# Altium schematic sheet GZ7_1_x-CORE.SchDoc: GZ8-4-0
size B; SheetNumber: 3; SheetTotal: 10
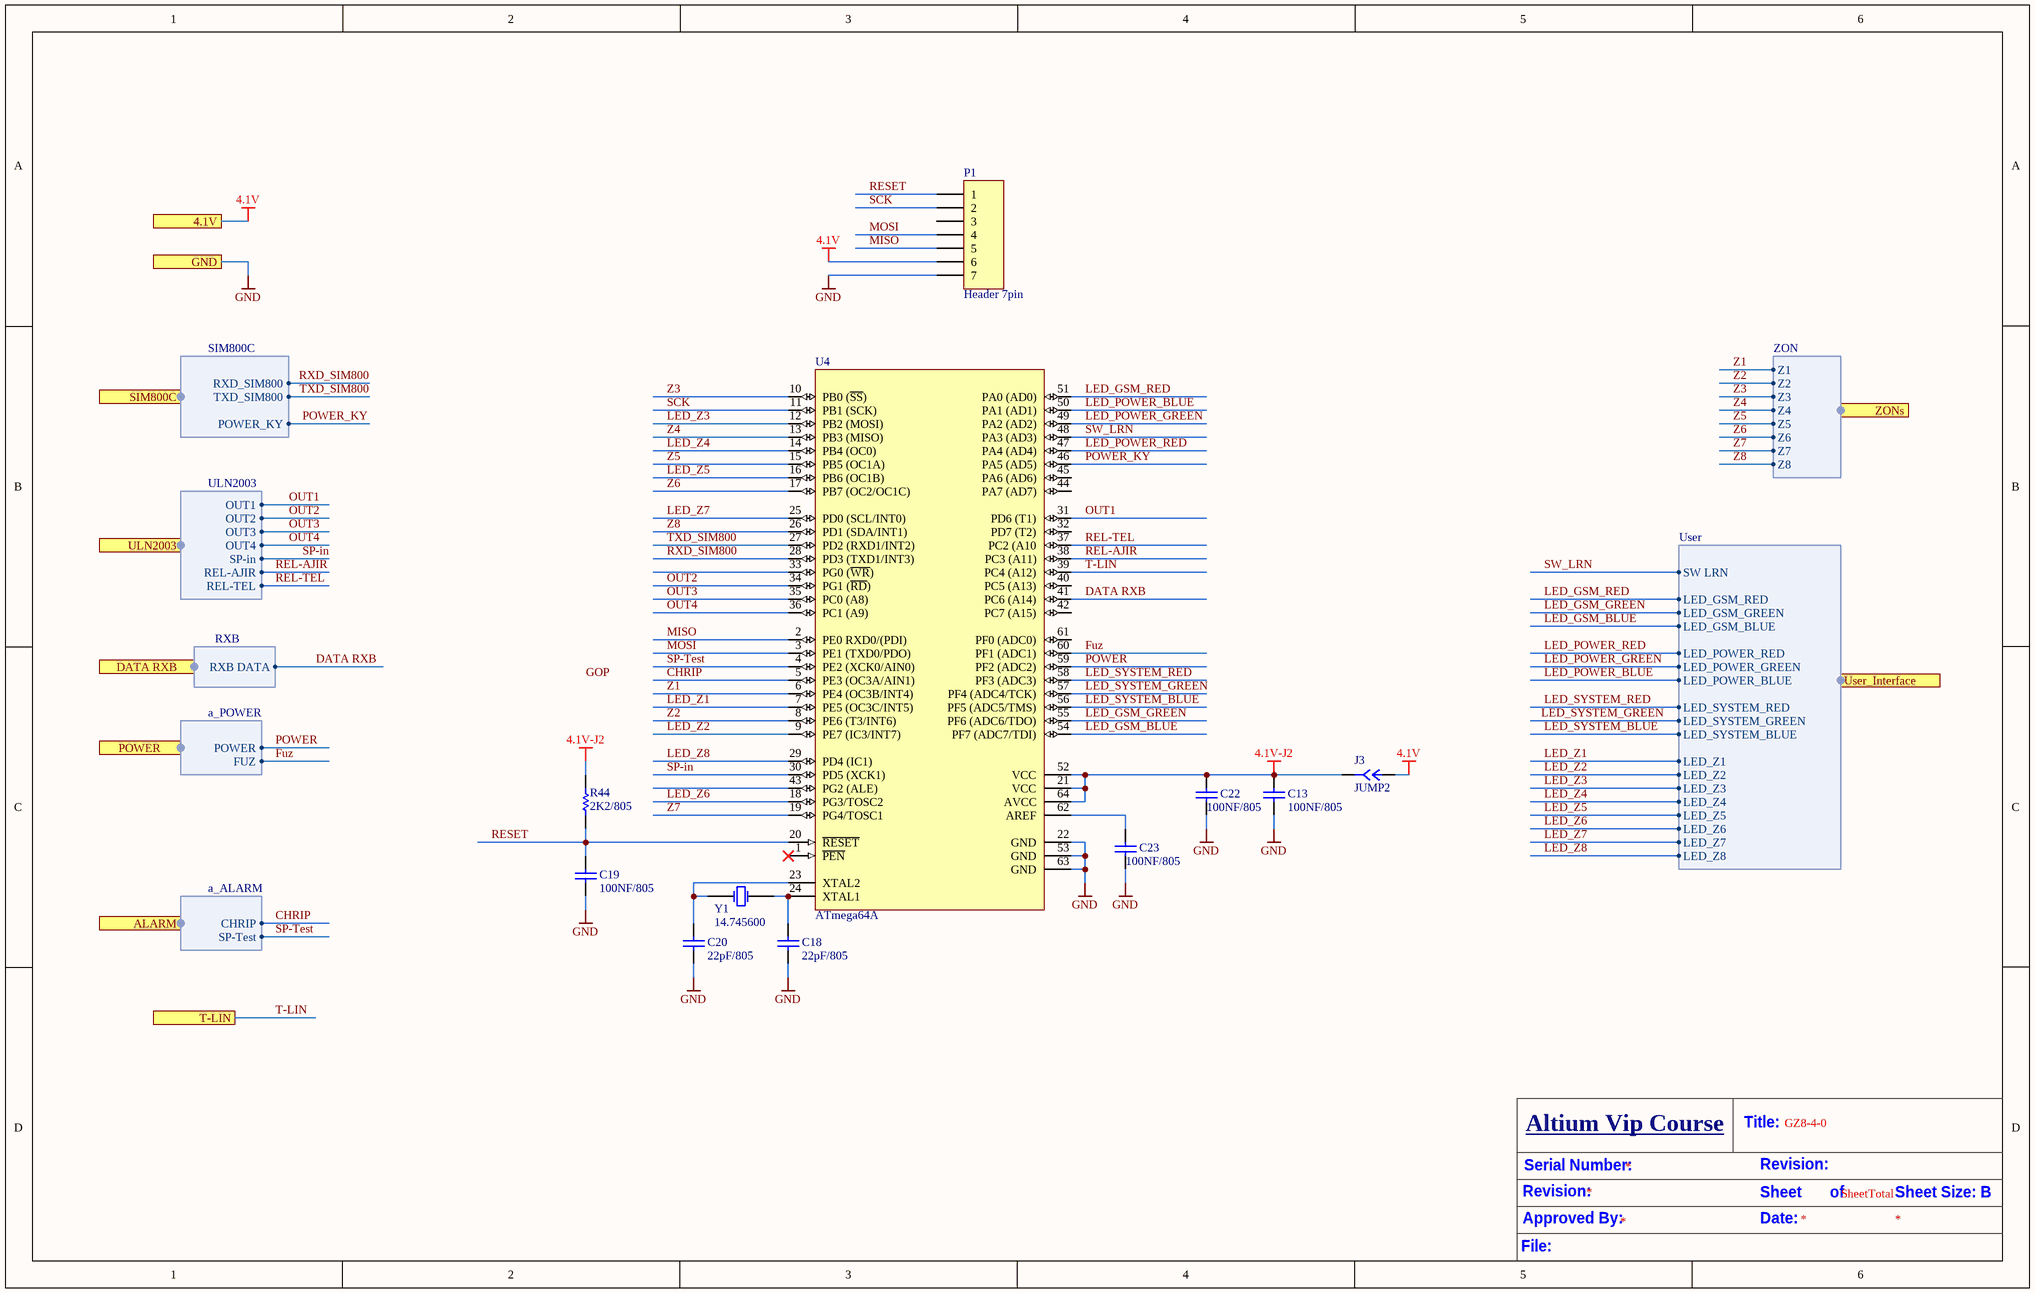
[diagram p0: GZ7_1_x-CORE.SchDoc]

## Parts
C13  100NF/805  [MY805 COP]
C18  22pF/805  [MY805 COP]
C19  100NF/805  [MY805 COP]
C20  22pF/805  [MY805 COP]
C22  100NF/805  [MY805 COP]
C23  100NF/805  [MY805 COP]
J3  JUMP2  [JUMP3]
P1  Header 7pin  [HDR_P_GZ4]
R44  2K2/805  [my805]
U4  ATmega64A  [TQFP64_GZ4E_1]
Y1  14.745600  [Crystal SMD]

## Ports
4.1V, ALARM (harness a_ALARM), DATA RXB (harness RXB), GND, POWER (harness a_POWER), SIM800C (harness SIM800C), T-LIN, ULN2003 (harness ULN2003), User_Interface (harness User), ZONs (harness ZON)

## Harnesses
SIM800C: TXD_SIM800, RXD_SIM800, POWER_KY
ULN2003: OUT1, OUT2, OUT3, SP-in, REL-AJIR, OUT4, REL-TEL
RXB: RXB DATA
a_POWER: POWER, FUZ
a_ALARM: SP-Test, CHRIP
ZON: Z1, Z2, Z3, Z4, Z5, Z6, Z7, Z8
User: SW LRN, LED_GSM_GREEN, LED_GSM_BLUE, LED_POWER_RED, LED_POWER_GREEN, LED_POWER_BLUE, LED_SYSTEM_RED, LED_SYSTEM_GREEN, LED_SYSTEM_BLUE, LED_GSM_RED, LED_Z1, LED_Z2, LED_Z3, LED_Z4, LED_Z5, LED_Z6, LED_Z7, LED_Z8

## Nets
4.1V: J3.2 P1.6 ; port 4.1V
4.1V-J2: C13.1 C22.1 J3.1 R44.1 U4.21(VCC) U4.52(VCC) U4.64(AVCC)
GND: C13.2 C18.2 C19.2 C20.2 C22.2 C23.2 P1.7 U4.22(GND) U4.53(GND) U4.63(GND) ; port GND
CHRIP: U4.5(PE3_(OC3A/AIN1)) ; port ALARM.CHRIP
DATA RXB: U4.41(PC6_(A14)) ; port DATA RXB.RXB DATA
Fuz: U4.60(PF1_(ADC1)) ; port POWER.FUZ
LED_GSM_BLUE: U4.54(PF7_(ADC7/TDI)) ; port User_Interface.LED_GSM_BLUE
LED_GSM_GREEN: U4.55(PF6_(ADC6/TDO)) ; port User_Interface.LED_GSM_GREEN
LED_GSM_RED: U4.51(PA0_(AD0)) ; port User_Interface.LED_GSM_RED
LED_POWER_BLUE: U4.50(PA1_(AD1)) ; port User_Interface.LED_POWER_BLUE
LED_POWER_GREEN: U4.49(PA2_(AD2)) ; port User_Interface.LED_POWER_GREEN
LED_POWER_RED: U4.47(PA4_(AD4)) ; port User_Interface.LED_POWER_RED
LED_SYSTEM_BLUE: U4.56(PF5_(ADC5/TMS)) ; port User_Interface.LED_SYSTEM_BLUE
LED_SYSTEM_GREEN: U4.57(PF4_(ADC4/TCK)) ; port User_Interface.LED_SYSTEM_GREEN
LED_SYSTEM_RED: U4.58(PF3_(ADC3)) ; port User_Interface.LED_SYSTEM_RED
LED_Z1: U4.7(PE5_(OC3C/INT5)) ; port User_Interface.LED_Z1
LED_Z2: U4.9(PE7_(IC3/INT7)) ; port User_Interface.LED_Z2
LED_Z3: U4.12(PB2_(MOSI)) ; port User_Interface.LED_Z3
LED_Z4: U4.14(PB4_(OC0)) ; port User_Interface.LED_Z4
LED_Z5: U4.16(PB6_(OC1B)) ; port User_Interface.LED_Z5
LED_Z6: U4.18(PG3/TOSC2) ; port User_Interface.LED_Z6
LED_Z7: U4.25(PD0_(SCL/INT0)) ; port User_Interface.LED_Z7
LED_Z8: U4.29(PD4_(IC1)) ; port User_Interface.LED_Z8
MISO: P1.5 U4.2(PE0_RXD0/(PDI))
MOSI: P1.4 U4.3(PE1_(TXD0/PDO))
OUT1: U4.31(PD6_(T1)) ; port ULN2003.OUT1
OUT2: U4.34(PG1_(~{RD})) ; port ULN2003.OUT2
OUT3: U4.35(PC0_(A8)) ; port ULN2003.OUT3
OUT4: U4.36(PC1_(A9)) ; port ULN2003.OUT4
POWER: U4.59(PF2_(ADC2)) ; port POWER.POWER
POWER_KY: U4.46(PA5_(AD5)) ; port SIM800C.POWER_KY
REL-AJIR: U4.38(PC3_(A11)) ; port ULN2003.REL-AJIR
REL-TEL: U4.37(PC2_(A10) ; port ULN2003.REL-TEL
RESET: C19.1 P1.1 R44.2 U4.20(~{RESET})
RXD_SIM800: U4.28(PD3_(TXD1/INT3)) ; port SIM800C.RXD_SIM800
SCK: P1.2 U4.11(PB1_(SCK))
SP-in: U4.30(PD5_(XCK1)) ; port ULN2003.SP-in
SP-Test: U4.4(PE2_(XCK0/AIN0)) ; port ALARM.SP-Test
SW_LRN: U4.48(PA3_(AD3)) ; port User_Interface.SW LRN
T-LIN: U4.39(PC4_(A12)) ; port T-LIN
TXD_SIM800: U4.27(PD2_(RXD1/INT2)) ; port SIM800C.TXD_SIM800
Z1: U4.6(PE4_(OC3B/INT4)) ; port ZONs.Z1
Z2: U4.8(PE6_(T3/INT6)) ; port ZONs.Z2
Z3: U4.10(PB0_(~{SS})) ; port ZONs.Z3
Z4: U4.13(PB3_(MISO)) ; port ZONs.Z4
Z5: U4.15(PB5_(OC1A)) ; port ZONs.Z5
Z6: U4.17(PB7_(OC2/OC1C)) ; port ZONs.Z6
Z7: U4.19(PG4/TOSC1) ; port ZONs.Z7
Z8: U4.26(PD1_(SDA/INT1)) ; port ZONs.Z8
NetC18_1: C18.1 U4.24(XTAL1) Y1.2(OSC2)
NetC20_1: C20.1 U4.23(XTAL2) Y1.1(OSC1)
NetC23_1: C23.1 U4.62(AREF)

Not connected (* = marked no-connect by the designer): P1 3; U4 1(~{PEN})* 32(PD7_(T2)) 33(PG0_(~{WR})) 40(PC5_(A13)) 42(PC7_(A15)) 43(PG2_(ALE)) 44(PA7_(AD7)) 45(PA6_(AD6)) 61(PF0_(ADC0))

## Notes on the sheet
- Labels drawn without touching a wire or pin: GOP
- Serial Number:
- Altium Vip Course
- Title:
- Revision:
- Approved By:
- Date:
- Sheet       of
- SheetTotal
- Sheet Size: B
- File:

## Library data of the parts
C13 C19 C22 C23 = Cap Semi: CAP 0805; Value: 100pF; Published: 8-Jun-2000; LatestRevisionDate: 29-May-2009; LatestRevisionNote: IPC-7351 Footprint Added.; PackageReference: C1206; Publisher: Altium Limited; PackageDescription: Chip Capacitor
C18 C20 = Cap Semi: CAP 0805; Value: 22pF; Published: 8-Jun-2000; LatestRevisionDate: 29-May-2009; LatestRevisionNote: IPC-7351 Footprint Added.; PackageReference: C1206; Publisher: Altium Limited; PackageDescription: Chip Capacitor
P1 = Header 7: Header, 7-Pin; LatestRevisionDate: 17-Jul-2002; LatestRevisionNote: Re-released for DXP Platform.; Publisher: Altium Limited
R44 = Res1: RES 805; Value: 10K; Published: 8-Jun-2000; LatestRevisionDate: 17-Jul-2002; LatestRevisionNote: Re-released for DXP Platform.; PackageReference: AXIAL-0.3; Publisher: Altium Limited
U4 = ATmega64-16AC: 8-Bit AVR Microcontroller; Published: 17-Sep-2003; LatestRevisionDate: 13-Apr-2006; LatestRevisionNote: IPC-7351 Footprint Added.; DatasheetVersion: 2490C-AVR-009/02; PackageVersion: revB, Oct-2001; PackageReference: 64A; Publisher: Altium Limited; PackageDescription: 64-Pin Thin Quad Flat Pack 0.8 mm Pitch; Code_JEDEC: MS-026-AEB; ComponentLink1Description: Manufacturer Link; ComponentLink1URL: http://www.atmel.com; ComponentLink2Description: Datasheet; ComponentLink2URL: http://www.atmel.com/dyn/resources/prod_documents/doc2490.pdf
Y1 = XTAL: Crystal Oscillator; Published: 8-Jun-2000; LatestRevisionDate: 17-Jul-2002; LatestRevisionNote: Re-released for DXP Platform.; PackageReference: R38; Publisher: Altium Limited